# EAGLE design usbxlater (EAGLE 6.4)
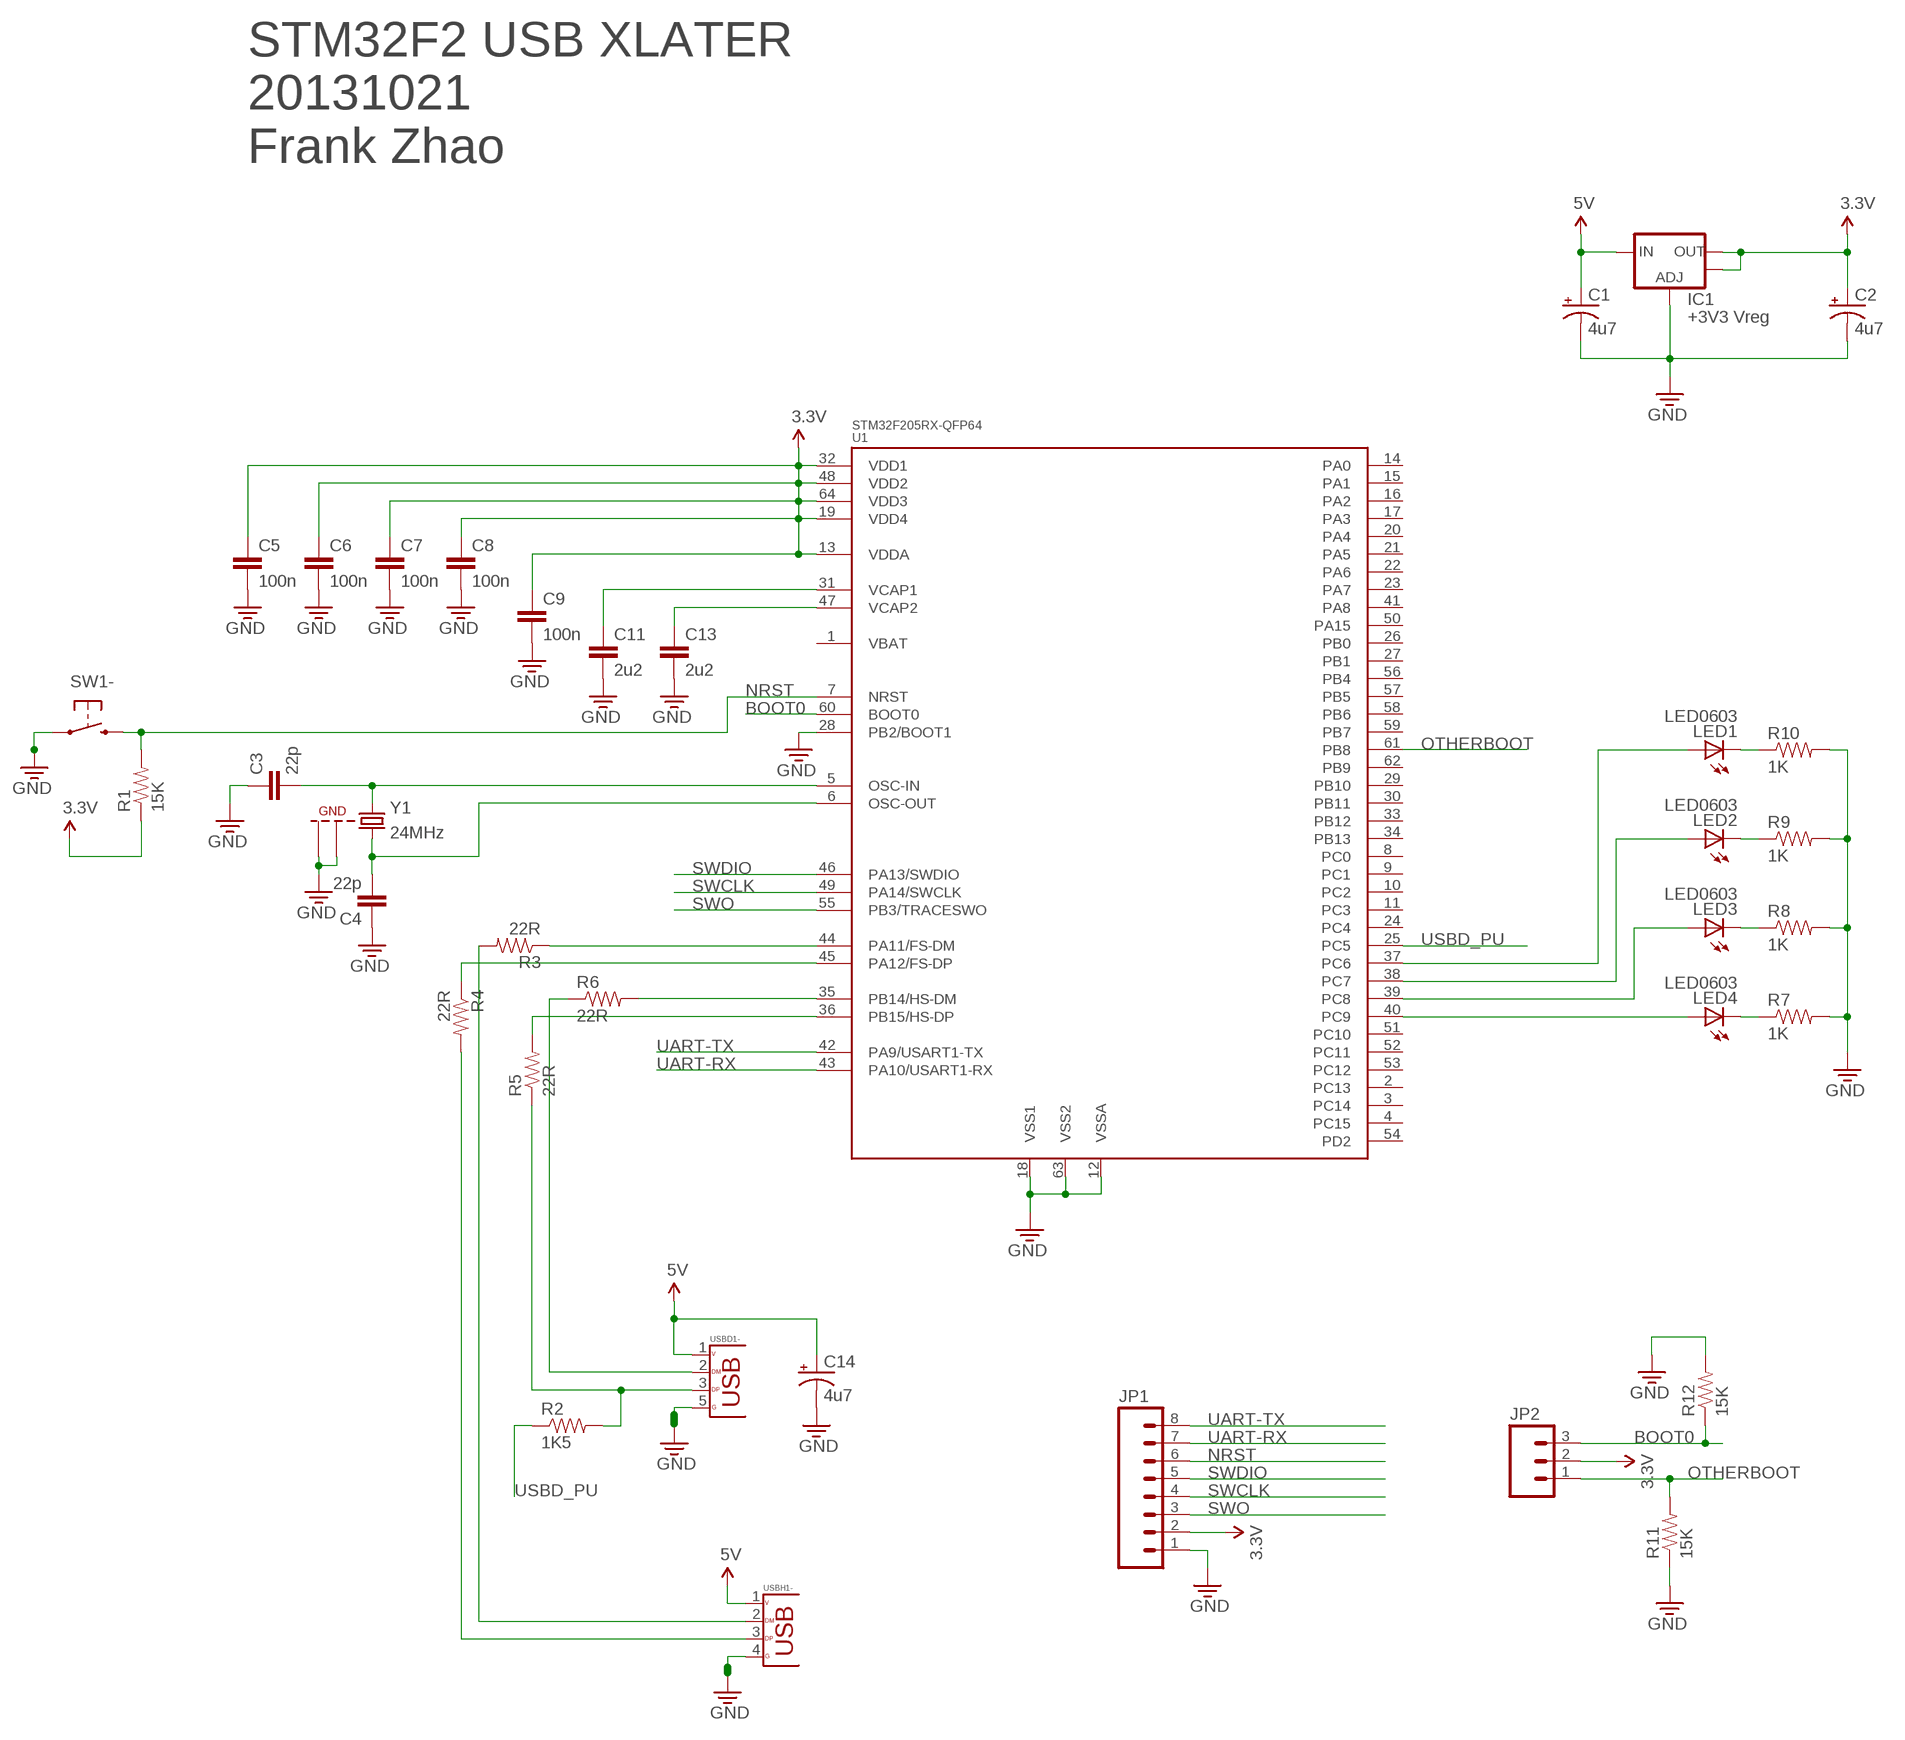
[diagram p0: schematic, sheet 1]

## Parts
C1  4u7  CAP_POL1206  [EIA3216]
C2  4u7  CAP_POL1206  [EIA3216]
C3  22p  CAP0603-CAP-NOLEAK  [0603-CAP-NOLEAK]
C4  22p  CAP0603-CAP-NOLEAK  [0603-CAP-NOLEAK]
C5  100n  CAP0603-CAP-NOLEAK  [0603-CAP-NOLEAK]
C6  100n  CAP0603-CAP-NOLEAK  [0603-CAP-NOLEAK]
C7  100n  CAP0603-CAP-NOLEAK  [0603-CAP-NOLEAK]
C8  100n  CAP0603-CAP-NOLEAK  [0603-CAP-NOLEAK]
C9  100n  CAP0603-CAP-NOLEAK  [0603-CAP-NOLEAK]
C11  2u2  CAP0603-CAP-NOLEAK  [0603-CAP-NOLEAK]
C13  2u2  CAP0603-CAP-NOLEAK  [0603-CAP-NOLEAK]
C14  4u7  CAP_POL1206  [EIA3216]
IC1  +3V3 Vreg  V_REG_LM1117SOT223  [SOT223]
JP1  M081X08  [1X08]
JP2  M03PTH  [1X03]
LED1  LED0603  [LED-0603]
LED2  LED0603  [LED-0603]
LED3  LED0603  [LED-0603]
LED4  LED0603  [LED-0603]
R1  15K  RESISTOR0603-RES  [0603-RES]
R2  1K5  RESISTOR0603-RES  [0603-RES]
R3  22R  RESISTOR0603-RES  [0603-RES]
R4  22R  RESISTOR0603-RES  [0603-RES]
R5  22R  RESISTOR0603-RES  [0603-RES]
R6  22R  RESISTOR0603-RES  [0603-RES]
R7  1K  RESISTOR0603-RES-NOLEAK  [0603-RES-NOLEAK]
R8  1K  RESISTOR0603-RES  [0603-RES]
R9  1K  RESISTOR0603-RES-NOLEAK  [0603-RES-NOLEAK]
R10  1K  RESISTOR0603-RES  [0603-RES]
R11  15K  RESISTOR0603-RES-NOLEAK  [0603-RES-NOLEAK]
R12  15K  RESISTOR0603-RES-NOLEAK  [0603-RES-NOLEAK]
SW1  SWITCH-B3U-1100-BOSS  [SWITCH-TACT-B3U-1100P-B]
U1  STM32F205RX-QFP64  [TQFP64]
USBD1  USB-6S-MICRO_B  [USB_MICRO_B]
USBH1  USB-A-RV  [USB-A-RV]
Y1  24MHz  CRYSTAL_SMD_GND-3.2X2.5  [CRYSTAL-SMD-3.2X2.5]

## Nets
3.3V: C2.A(+) C5.1 C6.1 C7.1 C8.1 C9.1 IC1.2(OUT) IC1.4(OUT) JP1.2 JP2.2 R1.1 U1.13(VDDA) U1.19(VDD4) U1.32(VDD1) U1.48(VDD2) U1.64(VDD3)
5V: C1.A(+) C14.A(+) IC1.3(IN) USBD1.1(-:VBUS) USBH1.1(-:VBUS)
BOOT0: JP2.3 R12.1 U1.60(BOOT0)
GND: C1.C(-) C2.C(-) C3.1 C4.1 C5.2 C6.2 C7.2 C8.2 C9.2 C11.2 C13.2 C14.C(-) IC1.1(ADJ) JP1.1 R7.2 R8.2 R9.2 R10.2 R11.1 R12.2 SW1.1 SW1.BOSS U1.12(VSSA) U1.18(VSS1) U1.28(PB2/BOOT1) U1.63(VSS2) USBD1.5(-:GND) USBD1.P$1 USBD1.P$2 USBD1.P$3 USBD1.P$4 USBD1.S1 USBD1.S2 USBH1.4(-:GND) USBH1.S1 USBH1.S2 USBH1.S3 USBH1.S4 Y1.2(GND1) Y1.4(GND2)
N$1: C3.2 U1.5(OSC-IN) Y1.1
N$2: LED1.C R10.1
N$3: R4.2 USBH1.3(-:D+)
N$4: R3.2 USBH1.2(-:D-)
N$5: LED2.C R9.1
N$6: C4.2 U1.6(OSC-OUT) Y1.3
N$7: C13.1 U1.47(VCAP2)
N$8: LED3.C R8.1
N$9: C11.1 U1.31(VCAP1)
N$10: LED4.C R7.1
N$11: LED4.A U1.40(PC9)
N$12: R4.1 U1.45(PA12/FS-DP)
N$13: R3.1 U1.44(PA11/FS-DM)
N$14: LED3.A U1.39(PC8)
N$15: LED2.A U1.38(PC7)
N$16: LED1.A U1.37(PC6)
N$26: R6.2 U1.35(PB14/HS-DM)
N$27: R5.2 U1.36(PB15/HS-DP)
N$28: R6.1 USBD1.2(-:D-)
N$29: R2.2 R5.1 USBD1.3(-:D+)
NRST: JP1.6 R1.2 SW1.2 U1.7(NRST)
OTHERBOOT: JP2.1 R11.2 U1.61(PB8)
SWCLK: JP1.4 U1.49(PA14/SWCLK)
SWDIO: JP1.5 U1.46(PA13/SWDIO)
SWO: JP1.3 U1.55(PB3/TRACESWO)
UART-RX: JP1.7 U1.43(PA10/USART1-RX)
UART-TX: JP1.8 U1.42(PA9/USART1-TX)
USBD_PU: R2.1 U1.25(PC5)
Unconnected: U1.1(VBAT) U1.2(PC13) U1.3(PC14) U1.4(PC15) U1.8(PC0) U1.9(PC1) U1.10(PC2) U1.11(PC3) U1.14(PA0) U1.15(PA1) U1.16(PA2) U1.17(PA3) U1.20(PA4) U1.21(PA5) U1.22(PA6) U1.23(PA7) U1.24(PC4) U1.26(PB0) U1.27(PB1) U1.29(PB10) U1.30(PB11) U1.33(PB12) U1.34(PB13) U1.41(PA8) U1.50(PA15) U1.51(PC10) U1.52(PC11) U1.53(PC12) U1.54(PD2) U1.56(PB4) U1.57(PB5) U1.58(PB6) U1.59(PB7) U1.62(PB9)

## Notes on the sheet
- STM32F2 USB XLATER
  20131021
  Frank Zhao

## Library data of the parts
C1 C2 C14 = usbxlater:CAP_POL: Capacitor Polarized These are standard SMD and PTH capacitors. Normally 10uF, 47uF, and 100uF in electrolytic and tantalum varieties. Always verify the external diameter of the through hole cap, it varies with capacity, voltage, and manufacturer. The EIA devices should be standard.
C3-C9 C11 C13 = usbxlater:CAP: Capacitor Standard 0603 ceramic capacitor, and 0.1" leaded capacitor.
IC1 = usbxlater:V_REG_LM1117: Voltage Regulator LM1117 Standard adjustable voltage regulator but in SMD form. Spark Fun Electronics SKU : COM-00595
JP1 = usbxlater:M08: Header 8 Standard 8-pin 0.1" header. Use with straight break away headers (SKU : PRT-00116), right angle break away headers (PRT-00553), swiss pins (PRT-00743), machine pins (PRT-00117), and female headers (PRT-00115).
JP2 = usbxlater:M03: Header 3 Standard 3-pin 0.1" header. Use with straight break away headers (SKU : PRT-00116), right angle break away headers (PRT-00553), swiss pins (PRT-00743), machine pins (PRT-00117), and female headers (PRT-00115). Molex polarized connector foot print use with SKU : PRT-08232 with associated crimp pins and housings.
LED1-LED4 = usbxlater:LED: LEDs Standard schematic elements and footprints for 5mm, 3mm, 1206, and 0603 sized LEDs. 5mm - Spark Fun Electronics SKU : COM-00529 (and others)
R1-R12 = usbxlater:RESISTOR: Resistor Basic schematic elements and footprints for 0603, 1206, and PTH resistors.
SW1 = usbxlater:SWITCH-B3U-1100
U1 = usbxlater:STM32F205RX
USBD1 = usbxlater:USB-6S
USBH1 = usbxlater:USB: USB Connectors USB-B-PTH is fully proven SKU : PRT-00139 USB-miniB is fully proven SKU : PRT-00587 USB-A-PCB is untested. USB-A-H is throughly reviewed, but untested. Spark Fun Electronics SKU : PRT-00437 USB-B-SMT is throughly reviewed, but untested. Needs silkscreen touching up. USB-A-S has not been used/tested USB-MB-H has not been used/tested
Y1 = usbxlater:CRYSTAL_SMD_GND

## Board
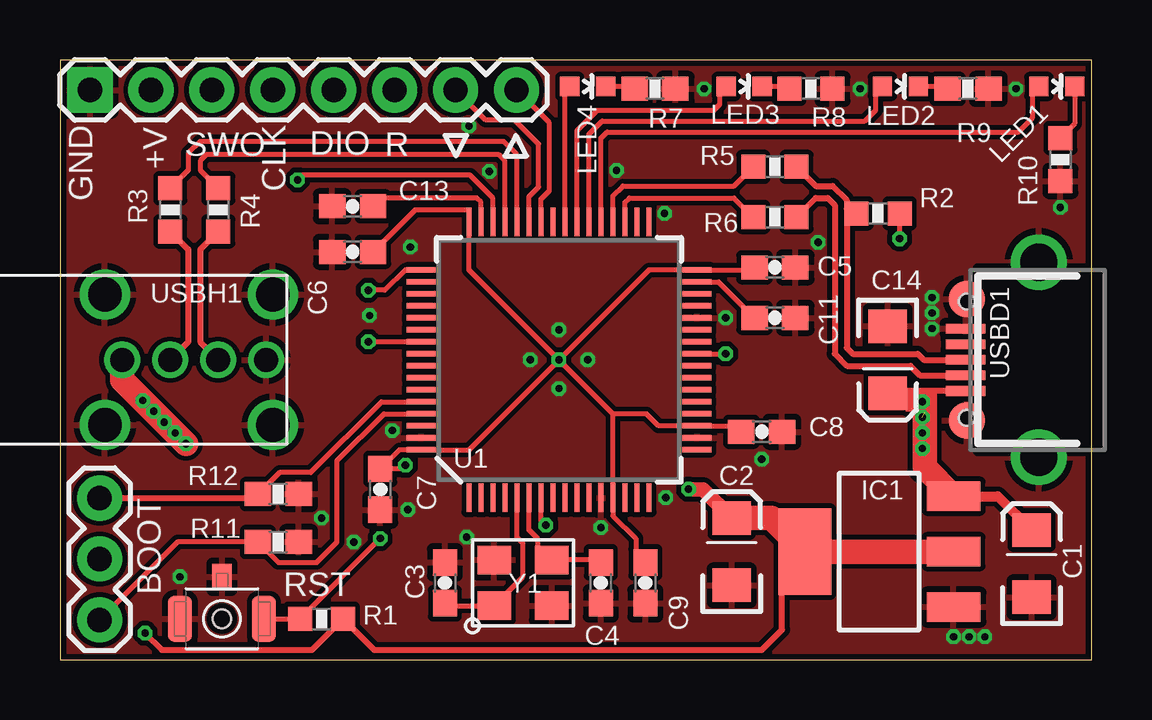
[diagram p1: board, top side]
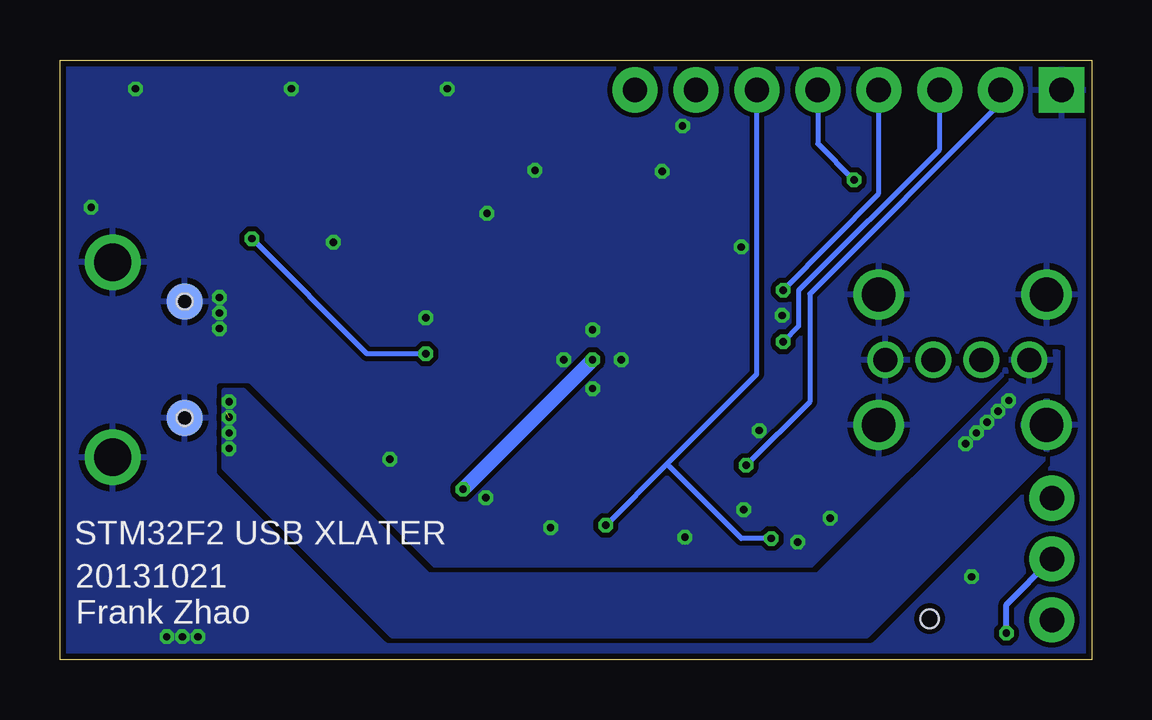
[diagram p2: board, bottom side, seen from below]

Size 43 x 25 mm. Coordinates in mm from the lower left corner, seen from the top.
Outline: 0,0 43,0 43,25 0,25 0,0
Copper layers (1*16): Top 0.035mm / dielectric 1.5mm / Bottom 0.035mm
Design rules "Fusion_eagle_rule_v1.1_TentedVias3": minimum track width 6mil, minimum drill 0.3mm, track to track 7mil, track to pad 7mil, pad to pad 7mil, via to via 7mil, smd to smd 0mil, copper to edge 10mil, drill to drill 10mil, minimum pad ring 10mil, minimum via ring 6mil, stop-mask expansion 2mil, vias tented up to drill 25mil, thermal gap 10mil
tRestrict: 4 lines

### Footprints (pad centres in the part's own frame; a part is rotated, then mirrored left to right if it is on the bottom)
EIA3216 = smd 1.4 x 1.6: A 1.4,0; C -1.4,0
0603-CAP-NOLEAK = smd 1.1 x 1: 1 -0.85,0; 2 0.85,0
SOT223 = smd 1.219 x 2.235: 1 -2.311,-3.099; 2 0,-3.099; 3 2.311,-3.099 | smd 3.6 x 2.2: 4 0,3.099
1X08 = drill 1.016 pad 1.88 square: 1 0,0 | drill 1.016 pad 1.88: 2 2.54,0; 3 5.08,0; 4 7.62,0; 5 10.16,0; 6 12.7,0; 7 15.24,0; 8 17.78,0
1X03 = drill 1.016 pad 1.88: 1 0,0; 2 2.54,0; 3 5.08,0
LED-0603 = smd 0.8 x 0.8: A 0,-0.75; C 0,0.75
0603-RES = smd 1 x 1: 1 -0.9,0; 2 0.9,0
0603-RES-NOLEAK = smd 1.1 x 1: 1 -0.85,0; 2 0.85,0
SWITCH-TACT-B3U-1100P-B = smd 1 x 1.9: 1 -1.75,0; 2 1.75,0 | smd 0.8 x 1.1: BOSS 0,1.75 | hole 0.762: 0,0
TQFP64 = smd 0.22 x 1.2: 1 -3.75,-5.75; 2 -3.25,-5.75; 3 -2.75,-5.75; 4 -2.25,-5.75; 5 -1.75,-5.75; 6 -1.25,-5.75; 7 -0.75,-5.75; 8 -0.25,-5.75; 9 0.25,-5.75; 10 0.75,-5.75; 11 1.25,-5.75; 12 1.75,-5.75; 13 2.25,-5.75; 14 2.75,-5.75; 15 3.25,-5.75; 16 3.75,-5.75; 33 3.75,5.75; 34 3.25,5.75; 35 2.75,5.75; 36 2.25,5.75; 37 1.75,5.75; 38 1.25,5.75; 39 0.75,5.75; 40 0.25,5.75; 41 -0.25,5.75; 42 -0.75,5.75; 43 -1.25,5.75; 44 -1.75,5.75; 45 -2.25,5.75; 46 -2.75,5.75; 47 -3.25,5.75; 48 -3.75,5.75 | smd 1.2 x 0.22: 17 5.75,-3.75; 18 5.75,-3.25; 19 5.75,-2.75; 20 5.75,-2.25; 21 5.75,-1.75; 22 5.75,-1.25; 23 5.75,-0.75; 24 5.75,-0.25; 25 5.75,0.25; 26 5.75,0.75; 27 5.75,1.25; 28 5.75,1.75; 29 5.75,2.25; 30 5.75,2.75; 31 5.75,3.25; 32 5.75,3.75; 49 -5.75,3.75; 50 -5.75,3.25; 51 -5.75,2.75; 52 -5.75,2.25; 53 -5.75,1.75; 54 -5.75,1.25; 55 -5.75,0.75; 56 -5.75,0.25; 57 -5.75,-0.25; 58 -5.75,-0.75; 59 -5.75,-1.25; 60 -5.75,-1.75; 61 -5.75,-2.25; 62 -5.75,-2.75; 63 -5.75,-3.25; 64 -5.75,-3.75
USB_MICRO_B = smd 0.4 x 1.651: 1 -1.3,3.048; 2 -0.65,3.048; 3 0,3.048; 4 0.65,3.048; 5 1.3,3.048 | smd 1.524 x 1.524 bottom: P$1 -2.425,3; P$2 2.425,3 | smd 1.524 x 1.524: P$3 -2.54,3; P$4 2.54,3 | drill 1.55: S1 -4.064,0; S2 4.064,0 | hole 0.65: -2.425,3; 2.425,3
USB-A-RV = drill 1: 1 -3,0; 2 -1,0; 3 1,0; 4 3,0 | drill 1.4: S1 -3.73,2.72; S2 3.27,2.72; S3 -3.73,-2.72; S4 3.27,-2.72
CRYSTAL-SMD-3.2X2.5 = smd 1.4 x 1.2: 1 -1.2,-0.95; 2 1.2,-0.95; 3 1.2,0.95; 4 -1.2,0.95

### Placement (x,y rotation side)
C1  40.5,4 90 top
C2  28,4.5 90 top
C3  16.05,3.2 270 top
C4  22.55,3.2 90 top
C5  29.8,16.35 0 top
C6  12.2,17 180 top
C7  13.35,7.1 270 top
C8  29.25,9.5 0 top
C9  24.4,3.2 270 top
C11  29.8,14.25 0 top
C13  12.2,18.9 180 top
C14  34.5,12.5 270 top
IC1  34.15,4.5 90 top
JP1  1.25,23.75 0 top
JP2  1.65,1.65 90 top
LED1  41.55,23.9 270 top
LED2  35.03,23.9 270 top
LED3  28.52,23.9 270 top
LED4  22,23.9 270 top
R1  10.9,1.7 180 top
R2  34.1,18.6 180 top
R3  4.6,18.75 270 top
R4  6.6,18.75 270 top
R5  29.8,20.55 180 top
R6  29.8,18.45 180 top
R7  24.8,23.8 0 top
R8  31.3,23.8 0 top
R9  37.85,23.8 0 top
R10  41.7,20.85 270 top
R11  9.1,4.9 180 top
R12  9.1,6.9 0 top
SW1  6.75,1.7 0 top
U1  20.8,12.5 0 top
USBD1  40.8,12.5 90 top
USBH1  5.6,12.5 0 top
Y1  19.3,3.2 0 top

### Tracks (layer width: path | path; a pad name or v marks a point on that pad's centre or on a via)
3.3V  (via drill 0.3)
  Top 0.203: 28.85,16.25 U1.32 24.55,16.25 v20.8,12.5 | C9.1 24.4,4.15 24,4.55 24,5.05 23.05,6 U1.13 23.05,10.25 | v20.8,12.5 17.05,16.25 U1.48 17.05,18.75 14.8,18.75 C6.1 | v20.8,12.5 17.05,8.75 U1.64 14.15,8.75 C7.1 14.25,7.95 v14.4,8.1 | 23.05,10.25 v20.8,12.5 | C8.1 28.15,9.75 U1.19 24.95,9.75 24.45,10.25 23.05,10.25 | 30.1,3.55 IC1.4
  Top 0.254: 28.85,16.25 C5.1 | 30.1,3.55 30.1,1.25 29.25,0.4 13.1,0.4 R1.1 10.5,0.4 4.25,0.4 v3.55,1.1
  Top 0.61: C2.A 26.8,7.1 v26.2,7.1
  Top 1.016: IC1.2 IC1.4 29.65,5.9 C2.A
  Bottom 0.203: JP1.2 3.79,23.21 11.75,15.25 11.75,10.75 v14.4,8.1
  Bottom 0.254: v3.55,1.1 3.55,2.29 JP2.2
  Bottom 0.61: v26.2,7.1 v20.8,12.5
5V  (via drill 0.3)  (1 unrouted)
  Top 0.203: v35.95,10.75 35.95,11.2 35,11.2
  Top 0.254: USBD1.1 35,11.2 34.6,11.2 C14.A
  Top 0.406: IC1.3 39.09,6.81 C1.A
  Top 1.016: IC1.3 36.05,8.01 36.05,10.3 | USBH1.1 2.6,11.65 v5.25,9
  other vias: 35.95,10.1 35.95,9.45 35.95,8.8 4.8,9.45 4.35,9.9 3.9,10.35 3.45,10.8
  pour Top: 35.55,11.3 36.4,11.3 36.55,11.3
  pour Bottom (isolate 0.254): 1.4,12.8 3.35,12.8 3.35,11.56 11.41,3.5 27.65,3.5 35.35,11.2 36.15,11.2 36.15,8 29.16,1.01 9.36,1.01 1.4,8.97
BOOT0
  Top 0.203: U1.60 13.4,10.75 10.45,7.8 9.15,7.8 R12.1 8.08,6.73
  Top 0.254: JP2.3 8.08,6.73
GND  (via drill 0.3)
  other vias: 36.35,13.8 36.35,14.45 36.35,15.1 22.55,5.5 16.95,5.1 14.5,6.25 10.9,5.9 37.25,0.95 37.9,0.95 38.55,0.95 29.25,8.35 27.75,14.25 17.05,22.25 26.85,23.8 33.35,23.8 39.85,23.8 41.7,18.85 23.2,20.4 25.2,18.6 17.9,20.35 5,3.45 22,12.5 20.8,13.75 20.8,11.3 19.6,12.5 12.9,14.35 14.6,17.2 13.85,9.55 12.25,4.9 25.25,6.75 31.6,17.4
  pour Top (isolate 0.203, rank 6): 0,0 43,0 43,25 0,25
  pour Bottom (isolate 0.203, rank 6): 0,0 43,0 43,25 0,25
N$1
  Top 0.203: U1.5 19.05,5.1 arc90 19.1,5.05 19.3,4.85 19.3,3.45 Y1.1 16.15,2.25 C3.2
N$2
  Top 0.203: LED1.C 42.3,22.35 R10.1
N$3
  Top 0.254: R4.2 5.85,17.1 5.85,13.25 USBH1.3
N$4
  Top 0.254: R3.2 5.35,17.1 5.35,13.25 USBH1.2
N$5
  Top 0.203: LED2.C 36.9,23.9 R9.1
N$6
  Top 0.203: U1.6 19.55,5.4 19.9,5.05 19.9,4.15 Y1.3 22.45,4.15 C4.2
N$7
  Top 0.203: U1.47 17.55,19.07 17.37,19.25 13.05,19.25 C13.1
N$8
  Top 0.203: LED3.C 30.3,23.9 R8.1
N$9
  Top 0.203: U1.31 27.45,15.75 C11.1
N$10
  Top 0.203: LED4.C 23.85,23.9 R7.1
N$11
  Top 0.203: U1.40 21.05,23.9 LED4.A
N$12
  Top 0.203: U1.45 18.55,20.8 18.3,21.05 6.1,21.05 5.85,20.8 5.85,20.4 R4.1
N$13
  Top 0.203: U1.44 19.05,21.05 18.5,21.6 5.84,21.6 5.35,21.11 5.35,20.4 R3.1
N$14
  Top 0.203: U1.39 21.55,22.05 22.4,22.9 27.25,22.9 27.5,23.15 27.5,23.63 LED3.A
N$15
  Top 0.203: U1.38 22.05,21.9 22.6,22.45 33.55,22.45 34,22.9 34,23.9 LED2.A
N$16
  Top 0.203: U1.37 22.55,21.75 22.8,22 39.95,22 40.55,22.6 40.55,23.9 LED1.A
N$26
  Top 0.203: U1.35 23.55,19.07 23.73,19.25 28.1,19.25 R6.2
N$27
  Top 0.203: U1.36 23.05,19.34 23.46,19.75 28.1,19.75 R5.2
N$28
  Top 0.254: R6.1 31.5,19.25 32,19.25 32.3,18.95 32.3,12.75 32.8,12.25 35.45,12.25 35.85,11.85 USBD1.2
N$29
  Top 0.203: R2.2 32.8,18.6 32.8,18.8
  Top 0.254: R5.1 31.5,19.75 32.2,19.75 32.8,19.15 32.8,18.8 32.8,13 33.05,12.75 35.75,12.75 36,12.5 USBD1.3
NRST  (via drill 0.3)
  Top 0.203: v20.25,5.6 20.05,5.8 U1.7 | v13.35,5.05 R1.2 SW1.2
  Bottom 0.203: v20.25,5.6 17.7,8.15 | 17.7,8.15 13.95,11.9 JP1.6 | v13.35,5.05 14.6,5.05 17.7,8.15
OTHERBOOT
  Top 0.203: JP2.1 4.9,4.9 R11.2 9.1,4.05 10.7,4.05 11.55,4.9 11.55,8.3 13.5,10.25 U1.61
SWCLK  (via drill 0.3)
  Top 0.203: U1.49 14.4,16.25 13.55,15.4 v12.85,15.4
  Bottom 0.203: v12.85,15.4 8.87,19.43 JP1.4
SWDIO  (via drill 0.3)
  Top 0.203: U1.46 18.05,19.24 17.09,20.2 10.1,20.2 v9.9,20
  Bottom 0.203: JP1.5 11.41,21.51 v9.9,20
SWO  (via drill 0.3)
  Top 0.203: U1.55 v12.85,13.25
  Bottom 0.203: v12.85,13.25 12.2,13.9 12.2,15.4 6.33,21.27 JP1.3
UART-RX
  Top 0.203: JP1.7 17.74,22.5 18.95,22.5 19.95,21.5 19.95,19.7 19.55,19.3 U1.43
UART-TX
  Top 0.203: JP1.8 20.4,22.38 20.4,19.55 20.05,19.2 U1.42
USBD_PU  (via drill 0.3)
  Top 0.203: U1.25 v27.75,12.75 | v35,17.55 R2.1
  Bottom 0.203: v27.75,12.75 30.2,12.75 v35,17.55
(copper drawn outside any net)
  shapes: Top area x1

### Text on the board
tPlace: GND | +V | CLK | R | SWO | DIO | BOOT | RST
bPlace: STM32F2 USB XLATER | 20131021 / Frank Zhao